# Altium schematic sheet Sheet4.SchDoc
size A4
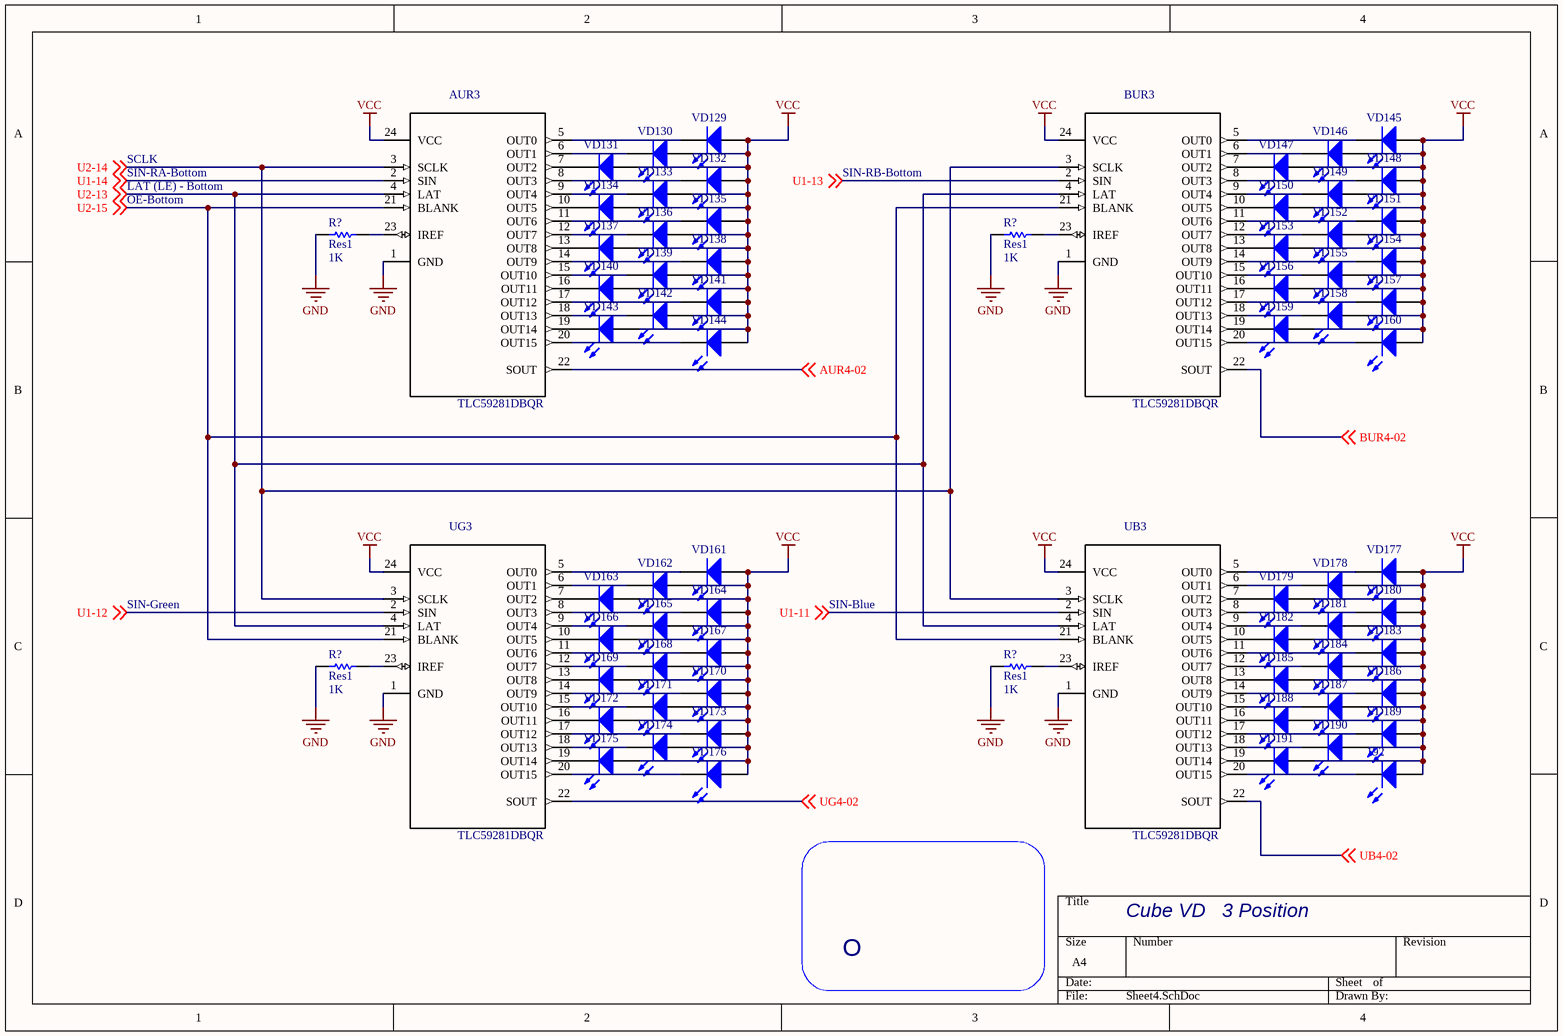
[diagram p0: Sheet4.SchDoc]

## Parts
(Parts that share a designator on the sheet are numbered #1, #2 ... from top to bottom, then left to right.)
192  LED  [LED-0]  (value not drawn)
AUR3  TLC59281DBQR  [SOP63P600X175-28N]
BUR3  TLC59281DBQR  [SOP63P600X175-28N]
R?#1  Res1  value 1K  [AXIAL-0.3]
R?#2  Res1  value 1K  [AXIAL-0.3]
R?#3  Res1  value 1K  [AXIAL-0.3]
R?#4  Res1  value 1K  [AXIAL-0.3]
UB3  TLC59281DBQR  [SOP63P600X175-28N]
UG3  TLC59281DBQR  [SOP63P600X175-28N]
VD129  LED  [LED-0]  (value not drawn)
VD130  LED  [LED-0]  (value not drawn)
VD131  LED  [LED-0]  (value not drawn)
VD132  LED  [LED-0]  (value not drawn)
VD133  LED  [LED-0]  (value not drawn)
VD134  LED  [LED-0]  (value not drawn)
VD135  LED  [LED-0]  (value not drawn)
VD136  (no value)  [LED-0]
VD137  LED  [LED-0]  (value not drawn)
VD138  (no value)  [LED-0]
VD139  LED  [LED-0]  (value not drawn)
VD140  LED  [LED-0]  (value not drawn)
VD141  LED  [LED-0]  (value not drawn)
VD142  LED  [LED-0]  (value not drawn)
VD143  LED  [LED-0]  (value not drawn)
VD144  LED  [LED-0]  (value not drawn)
VD145  LED  [LED-0]  (value not drawn)
VD146  LED  [LED-0]  (value not drawn)
VD147  LED  [LED-0]  (value not drawn)
VD148  LED  [LED-0]  (value not drawn)
VD149  LED  [LED-0]  (value not drawn)
VD150  LED  [LED-0]  (value not drawn)
VD151  LED  [LED-0]  (value not drawn)
VD152  LED  [LED-0]  (value not drawn)
VD153  LED  [LED-0]  (value not drawn)
VD154  LED  [LED-0]  (value not drawn)
VD155  LED  [LED-0]  (value not drawn)
VD156  LED  [LED-0]  (value not drawn)
VD157  LED  [LED-0]  (value not drawn)
VD158  LED  [LED-0]  (value not drawn)
VD159  LED  [LED-0]  (value not drawn)
VD160  LED  [LED-0]  (value not drawn)
VD161  LED  [LED-0]  (value not drawn)
VD162  LED  [LED-0]  (value not drawn)
VD163  LED  [LED-0]  (value not drawn)
VD164  LED  [LED-0]  (value not drawn)
VD165  LED  [LED-0]  (value not drawn)
VD166  LED  [LED-0]  (value not drawn)
VD167  LED  [LED-0]  (value not drawn)
VD168  LED  [LED-0]  (value not drawn)
VD169  LED  [LED-0]  (value not drawn)
VD170  LED  [LED-0]  (value not drawn)
VD171  LED  [LED-0]  (value not drawn)
VD172  LED  [LED-0]  (value not drawn)
VD173  LED  [LED-0]  (value not drawn)
VD174  LED  [LED-0]  (value not drawn)
VD175  LED  [LED-0]  (value not drawn)
VD176  LED  [LED-0]  (value not drawn)
VD177  LED  [LED-0]  (value not drawn)
VD178  LED  [LED-0]  (value not drawn)
VD179  LED  [LED-0]  (value not drawn)
VD180  LED  [LED-0]  (value not drawn)
VD181  LED  [LED-0]  (value not drawn)
VD182  LED  [LED-0]  (value not drawn)
VD183  LED  [LED-0]  (value not drawn)
VD184  LED  [LED-0]  (value not drawn)
VD185  LED  [LED-0]  (value not drawn)
VD186  LED  [LED-0]  (value not drawn)
VD187  LED  [LED-0]  (value not drawn)
VD188  LED  [LED-0]  (value not drawn)
VD189  LED  [LED-0]  (value not drawn)
VD190  LED  [LED-0]  (value not drawn)
VD191  LED  [LED-0]  (value not drawn)

## Nets
GND: AUR3.1(GND) BUR3.1(GND) R?#1.1 R?#2.1 R?#3.1 R?#4.1 UB3.1(GND) UG3.1(GND)
VCC: 192.1(A) AUR3.24(VCC) BUR3.24(VCC) UB3.24(VCC) UG3.24(VCC) VD129.1(A) VD130.1(A) VD131.1(A) VD132.1(A) VD133.1(A) VD134.1(A) VD135.1(A) VD136.1(A) VD137.1(A) VD138.1(A) VD139.1(A) VD140.1(A) VD141.1(A) VD142.1(A) VD143.1(A) VD144.1(A) VD145.1(A) VD146.1(A) VD147.1(A) VD148.1(A) VD149.1(A) VD150.1(A) VD151.1(A) VD152.1(A) VD153.1(A) VD154.1(A) VD155.1(A) VD156.1(A) VD157.1(A) VD158.1(A) VD159.1(A) VD160.1(A) VD161.1(A) VD162.1(A) VD163.1(A) VD164.1(A) VD165.1(A) VD166.1(A) VD167.1(A) VD168.1(A) VD169.1(A) VD170.1(A) VD171.1(A) VD172.1(A) VD173.1(A) VD174.1(A) VD175.1(A) VD176.1(A) VD177.1(A) VD178.1(A) VD179.1(A) VD180.1(A) VD181.1(A) VD182.1(A) VD183.1(A) VD184.1(A) VD185.1(A) VD186.1(A) VD187.1(A) VD188.1(A) VD189.1(A) VD190.1(A) VD191.1(A)
AUR4-02: AUR3.22(SOUT) ; off-sheet AUR4-02
BUR4-02: BUR3.22(SOUT) ; off-sheet BUR4-02
U1-11: UB3.2(SIN) ; off-sheet U1-11
U1-12: UG3.2(SIN) ; off-sheet U1-12
U1-13: BUR3.2(SIN) ; off-sheet U1-13
U1-14: AUR3.2(SIN) ; off-sheet U1-14
U2-13: AUR3.4(LAT) BUR3.4(LAT) UB3.4(LAT) UG3.4(LAT) ; off-sheet U2-13
U2-14: AUR3.3(SCLK) BUR3.3(SCLK) UB3.3(SCLK) UG3.3(SCLK) ; off-sheet U2-14
U2-15: AUR3.21(BLANK) BUR3.21(BLANK) UB3.21(BLANK) UG3.21(BLANK) ; off-sheet U2-15
UB4-02: UB3.22(SOUT) ; off-sheet UB4-02
UG4-02: UG3.22(SOUT) ; off-sheet UG4-02
Net192_2: 192.2(K) UB3.20(OUT15)
NetAUR3_5: AUR3.5(OUT0) VD129.2(K)
NetAUR3_6: AUR3.6(OUT1) VD130.2(K)
NetAUR3_7: AUR3.7(OUT2) VD131.2(K)
NetAUR3_8: AUR3.8(OUT3) VD132.2(K)
NetAUR3_9: AUR3.9(OUT4) VD133.2(K)
NetAUR3_10: AUR3.10(OUT5) VD134.2(K)
NetAUR3_11: AUR3.11(OUT6) VD135.2(K)
NetAUR3_12: AUR3.12(OUT7) VD136.2(K)
NetAUR3_13: AUR3.13(OUT8) VD137.2(K)
NetAUR3_14: AUR3.14(OUT9) VD138.2(K)
NetAUR3_15: AUR3.15(OUT10) VD139.2(K)
NetAUR3_16: AUR3.16(OUT11) VD140.2(K)
NetAUR3_17: AUR3.17(OUT12) VD141.2(K)
NetAUR3_18: AUR3.18(OUT13) VD142.2(K)
NetAUR3_19: AUR3.19(OUT14) VD143.2(K)
NetAUR3_20: AUR3.20(OUT15) VD144.2(K)
NetAUR3_23: AUR3.23(IREF) R?#1.2
NetBUR3_5: BUR3.5(OUT0) VD145.2(K)
NetBUR3_6: BUR3.6(OUT1) VD146.2(K)
NetBUR3_7: BUR3.7(OUT2) VD147.2(K)
NetBUR3_8: BUR3.8(OUT3) VD148.2(K)
NetBUR3_9: BUR3.9(OUT4) VD149.2(K)
NetBUR3_10: BUR3.10(OUT5) VD150.2(K)
NetBUR3_11: BUR3.11(OUT6) VD151.2(K)
NetBUR3_12: BUR3.12(OUT7) VD152.2(K)
NetBUR3_13: BUR3.13(OUT8) VD153.2(K)
NetBUR3_14: BUR3.14(OUT9) VD154.2(K)
NetBUR3_15: BUR3.15(OUT10) VD155.2(K)
NetBUR3_16: BUR3.16(OUT11) VD156.2(K)
NetBUR3_17: BUR3.17(OUT12) VD157.2(K)
NetBUR3_18: BUR3.18(OUT13) VD158.2(K)
NetBUR3_19: BUR3.19(OUT14) VD159.2(K)
NetBUR3_20: BUR3.20(OUT15) VD160.2(K)
NetBUR3_23: BUR3.23(IREF) R?#2.2
NetR?#3_2: R?#3.2 UG3.23(IREF)
NetR?#4_2: R?#4.2 UB3.23(IREF)
NetUB3_5: UB3.5(OUT0) VD177.2(K)
NetUB3_6: UB3.6(OUT1) VD178.2(K)
NetUB3_7: UB3.7(OUT2) VD179.2(K)
NetUB3_8: UB3.8(OUT3) VD180.2(K)
NetUB3_9: UB3.9(OUT4) VD181.2(K)
NetUB3_10: UB3.10(OUT5) VD182.2(K)
NetUB3_11: UB3.11(OUT6) VD183.2(K)
NetUB3_12: UB3.12(OUT7) VD184.2(K)
NetUB3_13: UB3.13(OUT8) VD185.2(K)
NetUB3_14: UB3.14(OUT9) VD186.2(K)
NetUB3_15: UB3.15(OUT10) VD187.2(K)
NetUB3_16: UB3.16(OUT11) VD188.2(K)
NetUB3_17: UB3.17(OUT12) VD189.2(K)
NetUB3_18: UB3.18(OUT13) VD190.2(K)
NetUB3_19: UB3.19(OUT14) VD191.2(K)
NetUG3_5: UG3.5(OUT0) VD161.2(K)
NetUG3_6: UG3.6(OUT1) VD162.2(K)
NetUG3_7: UG3.7(OUT2) VD163.2(K)
NetUG3_8: UG3.8(OUT3) VD164.2(K)
NetUG3_9: UG3.9(OUT4) VD165.2(K)
NetUG3_10: UG3.10(OUT5) VD166.2(K)
NetUG3_11: UG3.11(OUT6) VD167.2(K)
NetUG3_12: UG3.12(OUT7) VD168.2(K)
NetUG3_13: UG3.13(OUT8) VD169.2(K)
NetUG3_14: UG3.14(OUT9) VD170.2(K)
NetUG3_15: UG3.15(OUT10) VD171.2(K)
NetUG3_16: UG3.16(OUT11) VD172.2(K)
NetUG3_17: UG3.17(OUT12) VD173.2(K)
NetUG3_18: UG3.18(OUT13) VD174.2(K)
NetUG3_19: UG3.19(OUT14) VD175.2(K)
NetUG3_20: UG3.20(OUT15) VD176.2(K)

## Notes on the sheet
- SCLK
- SIN-RA-Bottom
- SIN-RB-Bottom
- OE-Bottom
- LAT (LE) - Bottom
- SIN-Green
- SIN-Blue
- Cube VD   3 Position
- O

## Library data of the parts
192 VD129-VD191 = LED0: Typical INFRARED GaAs LED; Published: 8-Jun-2000; LatestRevisionDate: 08-Jul-2005; LatestRevisionNote: Mech Layer 1 removed.; PackageReference: LED-0; Publisher: Altium Limited; PackageDescription: LED; 2 Leads
AUR3 BUR3 UB3 UG3 = TLC59281DBQR: 16-Channel, Constant-Current LED Driver without LED Open Detection 24-SSOP -40 to 85; MF: Texas Instruments; Price: 0.74 USD; Availability: Good; SnapEDA_Link: https://www.snapeda.com/parts/TLC59281DBQR/Texas%20Instruments/view-part/?ref=snap; MP: TLC59281DBQR; Package: SSOP-24 Texas Instruments; Value: *
R?#1-R?#4 = Res1: Resistor; Published: 8-Jun-2000; LatestRevisionDate: 17-Jul-2002; LatestRevisionNote: Re-released for DXP Platform.; PackageReference: AXIAL-0.3; Publisher: Altium Limited; PackageDescription: Axial Device, Thru-Hole; 2 Leads; 0.3 in Pin Spacing